# Altium schematic sheet PDM.SchDoc
size A
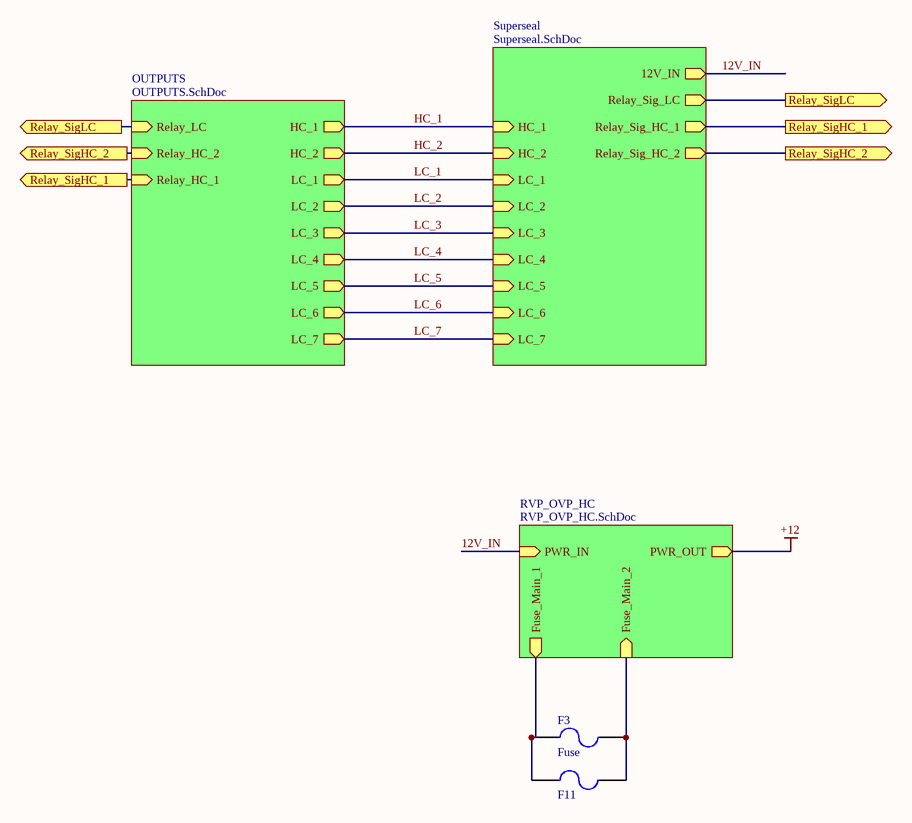
[diagram p0: PDM.SchDoc]

## Parts
F3  Fuse  [3568-MiniFuseHolder]
F11  Fuse  [3568-MiniFuseHolder]  (value not drawn)

## Sub-sheets
OUTPUTS = OUTPUTS.SchDoc: HC_1 (out), HC_2 (out), LC_1 (out), LC_2 (out), LC_3 (out), LC_4 (out), LC_5 (out), LC_6 (out), LC_7 (out), Relay_LC (in), Relay_HC_2 (in), Relay_HC_1 (in)
RVP_OVP_HC = RVP_OVP_HC.SchDoc: PWR_IN (in), Fuse_Main_1 (out), PWR_OUT (out), Fuse_Main_2 (in)
Superseal = Superseal.SchDoc: 12V_IN (out), LC_1 (in), LC_2 (in), LC_3 (in), LC_4 (in), LC_5 (in), LC_6 (in), LC_7 (in), Relay_Sig_LC (out), Relay_Sig_HC_1 (out), Relay_Sig_HC_2 (out), HC_2 (in), HC_1 (in)

## Ports
Relay_SigHC_1 (out), Relay_SigHC_2 (out), Relay_SigLC (out)

## Nets
+12: sheet RVP_OVP_HC/PWR_OUT
12V_IN: sheet RVP_OVP_HC/PWR_IN, sheet Superseal/12V_IN
HC_1: sheet OUTPUTS/HC_1, sheet Superseal/HC_1
HC_2: sheet OUTPUTS/HC_2, sheet Superseal/HC_2
LC_1: sheet OUTPUTS/LC_1, sheet Superseal/LC_1
LC_2: sheet OUTPUTS/LC_2, sheet Superseal/LC_2
LC_3: sheet OUTPUTS/LC_3, sheet Superseal/LC_3
LC_4: sheet OUTPUTS/LC_4, sheet Superseal/LC_4
LC_5: sheet OUTPUTS/LC_5, sheet Superseal/LC_5
LC_6: sheet OUTPUTS/LC_6, sheet Superseal/LC_6
LC_7: sheet OUTPUTS/LC_7, sheet Superseal/LC_7
Relay_SigHC_1: port Relay_SigHC_1, sheet OUTPUTS/Relay_HC_1, sheet Superseal/Relay_Sig_HC_1
Relay_SigHC_2: port Relay_SigHC_2, sheet OUTPUTS/Relay_HC_2, sheet Superseal/Relay_Sig_HC_2
Relay_SigLC: port Relay_SigLC, sheet OUTPUTS/Relay_LC, sheet Superseal/Relay_Sig_LC
NetF3_1: F3.1 F11.1 ; sheet RVP_OVP_HC/Fuse_Main_1
NetF3_2: F3.2 F11.2 ; sheet RVP_OVP_HC/Fuse_Main_2

## Library data of the parts
F3 F11 = 3: Manufacturer_id: 1; idFuse: 3; Name: 3568 Mini Fuse Holder; Drawer_id: 1
  F11: Link: https://www.digikey.com/product-detail/en/keystone-electronics/3568/36-3568-ND/2137306